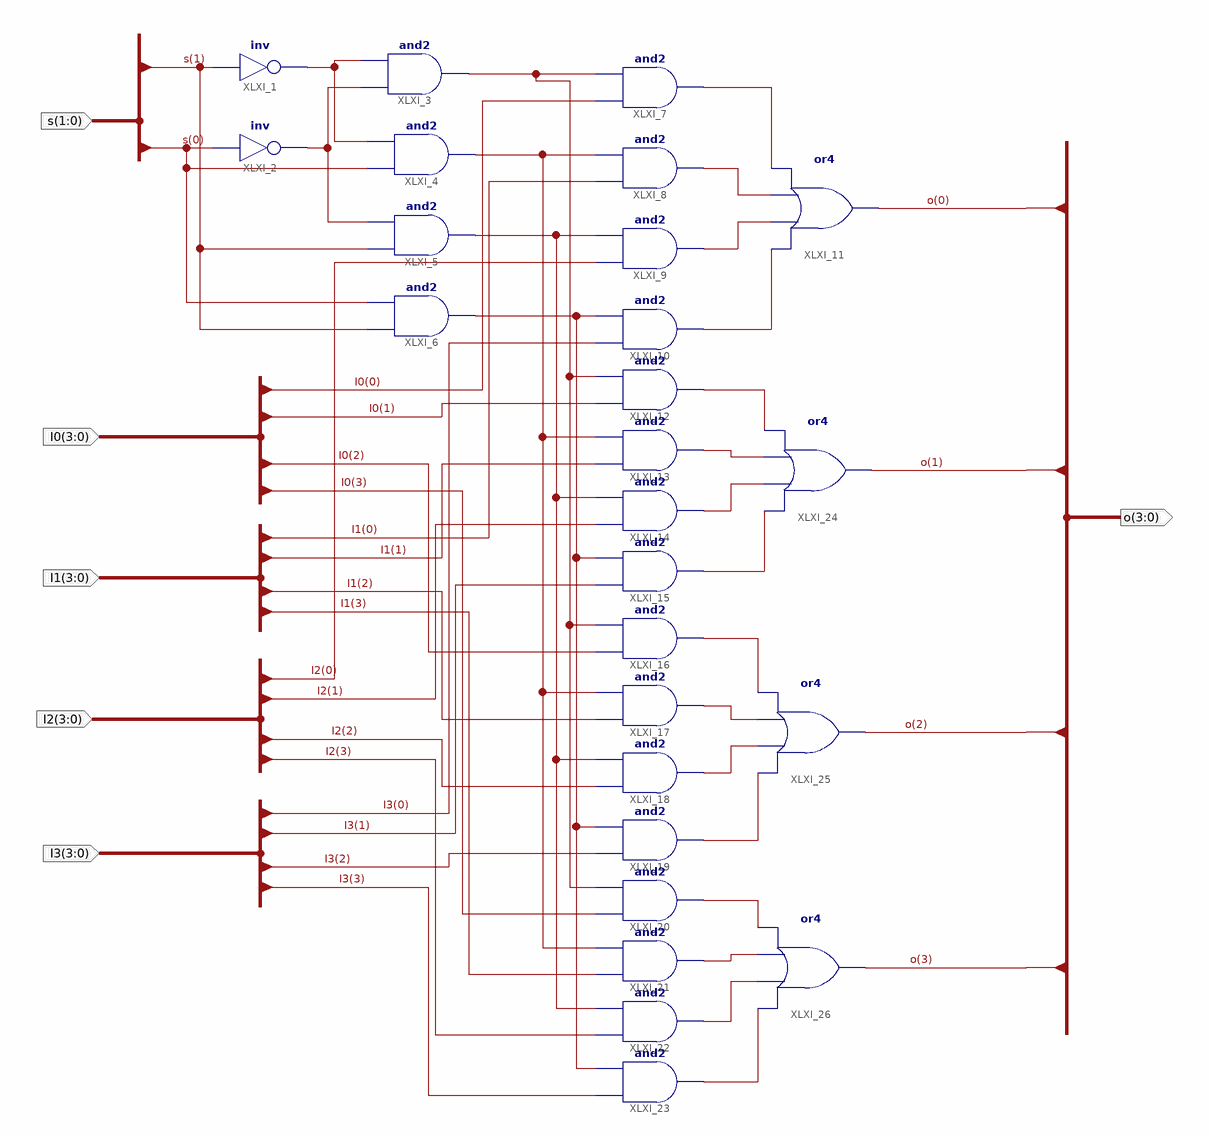
[diagram p0: schematic sheet 1]
// Xilinx ISE schematic MUX4T1_4.sch (kintex7) as structural Verilog: 26 symbols, 6 ports
module MUX4T1_4 (
  input  [1:0] s,
  input  [3:0] I0,
  input  [3:0] I1,
  input  [3:0] I2,
  input  [3:0] I3,
  output [3:0] o
);

  wire XLXN_6, XLXN_8, XLXN_10, XLXN_19, XLXN_20, XLXN_21, XLXN_22, XLXN_24, XLXN_25, XLXN_26, XLXN_27,
       XLXN_28, XLXN_29, XLXN_30, XLXN_31, XLXN_32, XLXN_33, XLXN_34, XLXN_35, XLXN_36, XLXN_39, XLXN_42;

  not XLXI_1 (XLXN_6, s[1]);
  not XLXI_2 (XLXN_8, s[0]);
  and XLXI_3 (XLXN_10, XLXN_8, XLXN_6);
  and XLXI_4 (XLXN_36, s[0], XLXN_6);
  and XLXI_5 (XLXN_39, s[1], XLXN_8);
  and XLXI_6 (XLXN_42, s[1], s[0]);
  and XLXI_8 (XLXN_20, I1[0], XLXN_36);
  and XLXI_9 (XLXN_21, I2[0], XLXN_39);
  and XLXI_7 (XLXN_19, I0[0], XLXN_10);
  and XLXI_10 (XLXN_22, I3[0], XLXN_42);
  or XLXI_11 (o[0], XLXN_22, XLXN_21, XLXN_20, XLXN_19);
  and XLXI_12 (XLXN_24, I0[1], XLXN_10);
  and XLXI_13 (XLXN_25, I1[1], XLXN_36);
  and XLXI_14 (XLXN_26, I2[1], XLXN_39);
  and XLXI_15 (XLXN_27, I3[1], XLXN_42);
  and XLXI_16 (XLXN_28, I0[2], XLXN_10);
  and XLXI_17 (XLXN_29, I1[2], XLXN_36);
  and XLXI_18 (XLXN_30, I2[2], XLXN_39);
  and XLXI_19 (XLXN_31, I3[2], XLXN_42);
  and XLXI_20 (XLXN_32, I0[3], XLXN_10);
  and XLXI_21 (XLXN_33, I1[3], XLXN_36);
  and XLXI_22 (XLXN_34, I2[3], XLXN_39);
  and XLXI_23 (XLXN_35, I3[3], XLXN_42);
  or XLXI_24 (o[1], XLXN_27, XLXN_26, XLXN_25, XLXN_24);
  or XLXI_25 (o[2], XLXN_31, XLXN_30, XLXN_29, XLXN_28);
  or XLXI_26 (o[3], XLXN_35, XLXN_34, XLXN_33, XLXN_32);
endmodule
